# Altium project ece315.PrjPcb
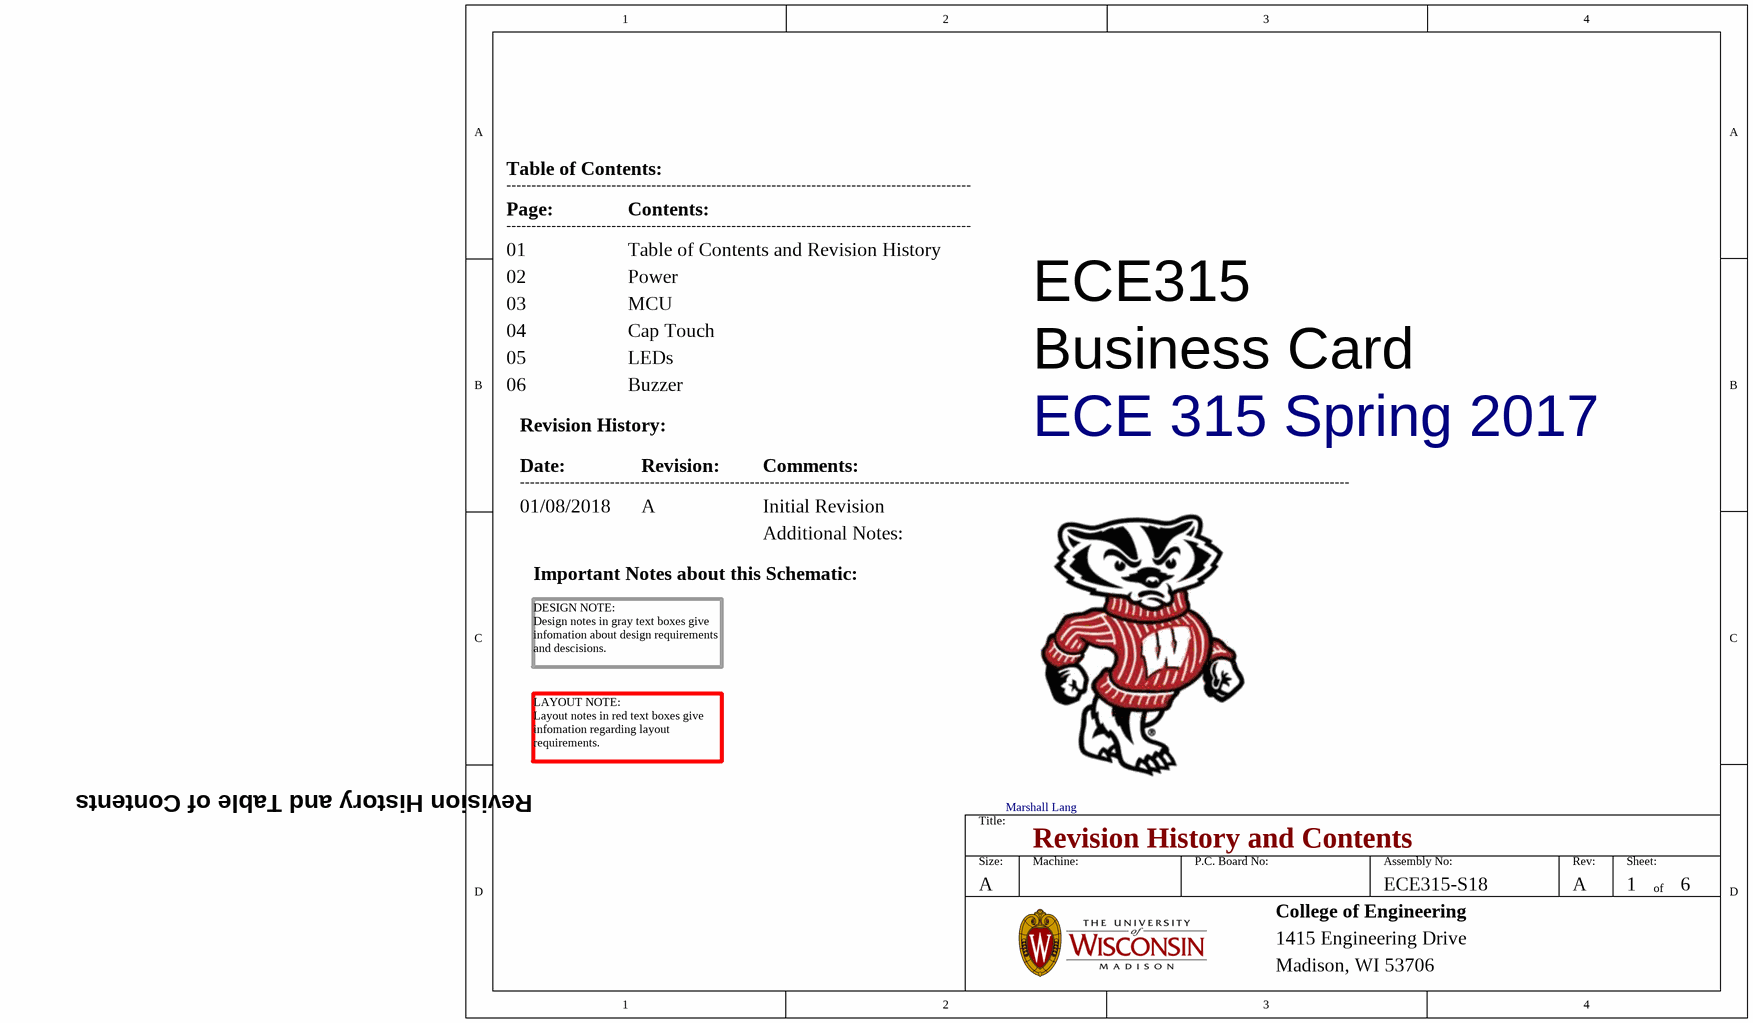
[diagram p0: 01-Revision_History_and_Contents.SchDoc]
AssemblyNumber: ECE315-S18
6 sheets, 65 parts. Net scope: global (net labels, ports and power ports of the same name join across sheets).
Board file: business_card.PcbDoc
Sheets:
  01-Revision_History_and_Contents.SchDoc
  02-Power.SchDoc
  03_MCU.SchDoc
  04_CapTouch.SchDoc
  05_LEDs.SchDoc
  06_Buzzer.SchDoc

## Sheet 01-Revision_History_and_Contents.SchDoc: Revision History and Contents
size A; Date: 01/08/2018; ApprovedBy: JSK; CheckedBy: JSK; Author: JSK; CompanyName: University of Wisconsin; DrawnBy: JSK; Engineer: JSK; Organization: ECE 315; Address1: College of Engineering; Address2: 1415 Engineering Drive; Address3: Madison, WI 53706; Address4: ECE 315 Spring 2017; Revision: A; SheetNumber: 1; SheetTotal: 6

### Notes on the sheet
- Table of Contents:
- Page:
- ---------------------------------------------------------------------------------------------
- Contents:
- 01
- 02
- Table of Contents and Revision History
- Power
- 03
- 04
- 05
- MCU
- Cap Touch
- LEDs
- ECE315
- 06
- Revision History:
- Buzzer
- Business Card
- Date:
- ----------------------------------------------------------------------------------------------------------------------------------------------------------------------
- Revision:
- Comments:
- 01/08/2018
- A
- Initial Revision
- Additional Notes:
- Important Notes about this Schematic:
- DESIGN NOTE:
  Design notes in gray text boxes give infomation about design requirements and descisions.
- LAYOUT NOTE:
  Layout notes in red text boxes give infomation regarding layout requirements.
- Revision History and Table of Contents
- Marshall Lang
- Title:
- Size:
- Machine:
- P.C. Board No:
- Assembly No:
- Rev:
- Sheet:
- of
- College of Engineering
- 1415 Engineering Drive
- Madison, WI 53706

## Sheet 02-Power.SchDoc: ECE315 Power and Programming
size A; Date: 01/08/2018; ApprovedBy: JSK; CheckedBy: JSK; Author: JSK; CompanyName: University of Wisconsin; DrawnBy: JSK; Engineer: JSK; Organization: ECE 315; Address1: College of Engineering; Address2: 1415 Engineering Drive; Address3: Madison, WI 53706; Address4: ECE 315 Spring 2018; Revision: A; SheetNumber: 2; SheetTotal: 6; AssemblyNumber: ECE315-S18; ApprovedDate: 4/25/2017
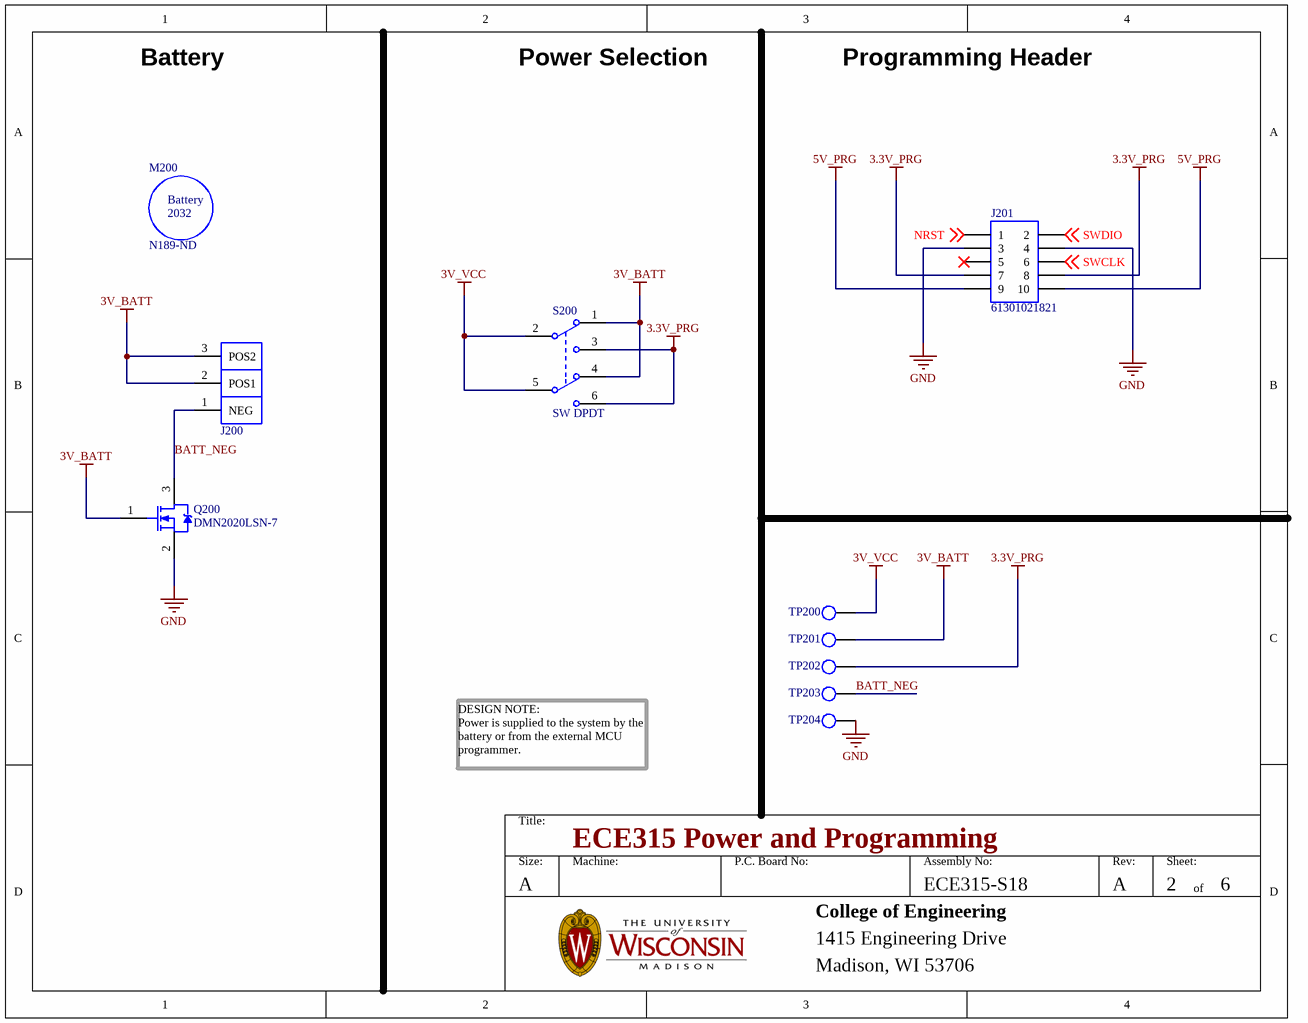
[diagram p1: 02-Power.SchDoc]

### Parts
J200  CONN_BAT_2032  [BATT_2032]  (value not drawn)
J201  Manufacturer Part Number: 61301021821  [HDR_5x2]  (hidden comment: CONN_ST_PROGRAMMER)
M200  Supplier Part Number 1: N189-ND  (hidden comment: BATTERY_2032)
Q200  Manufacturer Part Number: DMN2020LSN-7  [SOT23]  (hidden comment: IC_NMOS_DMN2020LSN)
S200  SW DPDT  [DPDT]
TP200  TP_1206  [TP-SMC-1206]  (value not drawn)
TP201  TP_1206  [TP-SMC-1206]  (value not drawn)
TP202  TP_1206  [TP-SMC-1206]  (value not drawn)
TP203  TP_1206  [TP-SMC-1206]  (value not drawn)
TP204  TP_1206  [TP-SMC-1206]  (value not drawn)

### Nets
3.3V_PRG: J201.7 J201.8 S200.3(NO1) S200.6(NO2) TP202.1
3V_BATT: J200.2(POS1) J200.3(POS2) Q200.1 S200.1(NC1) S200.4(NC2) TP201.1
3V_VCC: S200.2(COMMON1) S200.5(COMMON2) TP200.1
5V_PRG: J201.9 J201.10
GND: J201.3 J201.4 Q200.2 TP204.1
BATT_NEG: J200.1(NEG) Q200.3 TP203.1
NRST: J201.1 ; off-sheet NRST
SWCLK: J201.6 ; off-sheet SWCLK
SWDIO: J201.2 ; off-sheet SWDIO

Not connected (* = marked no-connect by the designer): J201 5*

### Notes on the sheet
- Battery
- Power Selection
- Programming Header
- DESIGN NOTE:
  Power is supplied to the system by the battery or from the external MCU programmer.
- Title:
- Size:
- A
- Machine:
- P.C. Board No:
- Assembly No:
- Rev:
- Sheet:
- of
- College of Engineering
- 1415 Engineering Drive
- Madison, WI 53706
- (in symbol BATTERY_2032) Battery; 2032

### Library data of the parts
J200 = CONN_BAT_2032: HOLDER BATTERY 20MM COIN; Manufacturer: Linx; Manufacturer Part Number: BAT-HLD-001; Brand: Linx Technologies; Number of Batteries: 1 Battery; Number of Contacts: 1 Contact; Battery Type, Function: Coin Cell, Retainer; Style: Retainer; Number of Cells: 1; Battery Series: 2025, 2032; Supplier 1: Digikey; Stock 1: 950; Pricing 1: 1=0.28, 25=0.2572, 100=0.233, 1000=0.2196 (USD); Product Category: Coin Cell Battery Holders; RoHS: Details; Product: Battery Holders; Battery Cell Size: 20 mm; Termination Style: SMD/SMT; Packaging: Bulk; Factory Pack Quantity: 1000; Type: 20 mm Battery Holder; ComponentLink1URL: https://datasheet.ciiva.com/4/bat-hld-001-4035.pdf; ComponentLink1Description: https://datasheet.ciiva.com/4/bat-hld-001-4035.pdf; ComponentLink2URL: https://datasheet.ciiva.com/4642/bat-hld-001-220194-4642567.pdf; ComponentLink2Description: https://datasheet.ciiva.com/4642/bat-hld-001-220194-4642567.pdf; ComponentLink3URL: https://datasheet.ciiva.com/16207/bat-hld-001-16207212.pdf; ComponentLink3Description: https://datasheet.ciiva.com/16207/bat-hld-001-16207212.pdf; Supplier Part Number 1: BAT-HLD-001-ND; Supplier 2: Digi-Key; Category: Battery Products; Stock 2: 69651; Pricing 2: 1=0.28, 25=0.2572, 100=0.233, 1000=0.2196 (USD); Part Status: Active; Mounting Type: PCB, Surface Mount; Height Above Board: 0.165" (4.20mm); Operating Temperature: -; ComponentLink4URL: https://www.linxtechnologies.com/resources/diagrams/bat-hld-001.pdf; ComponentLink4Description: https://www.linxtechnologies.com/resources/diagrams/bat-hld-001.pdf; Supplier Part Number 2: BAT-HLD-001-ND
J201 = CONN_ST_PROGRAMMER: CONN HEADER 2.54MM 10POS GOLD; Manufacturer: Wurth Electronics Inc.; Style: Board to Board; Number of Positions: 10; Number of Positions Loaded: All; Pitch - Mating: 0.100" (2.54mm); Contact Length - Post: 0.122" (3.10mm); Material Flammability Rating: UL94 V-0; Current Rating: 3A; Voltage Rating: 250VAC; Supplier 1: Digi-Key; RoHS: RoHS Compliant; Category: Connectors, Interconnects; Stock 1: 4086; Pricing 1: 1=0.74, 10=0.728, 50=0.672, 100=0.616, 320=0.56 (USD); Packaging: Tray; Part Status: Active; Connector Type: Header; Contact Type: Forked; Row Spacing - Mating: 0.100" (2.54mm); Mounting Type: Through Hole; Termination: Solder; Fastening Type: Push-Pull; Contact Finish - Mating: Gold; Contact Finish Thickness - Mating: -; Insulation Color: Black; Insulation Height: 0.331" (8.40mm); Operating Temperature: -40°C ~ 105°C; Contact Finish - Post: Gold; Mated Stacking Heights: -; Ingress Protection: -; Features: -; Applications: -; Insulation Material: Polybutylene Terephthalate (PBT); Contact Shape: Square; Contact Material: Copper Alloy; Contact Finish Thickness - Post: -; ComponentLink1URL: http://katalog.we-online.de/em/datasheet/6130xx21821.pdf; ComponentLink1Description: http://katalog.we-online.de/em/datasheet/6130xx21821.pdf; Supplier Part Number 1: 732-2861-ND
M200 = BATTERY_2032: Manufacturer: Energizer; Manufacturer Part Number: CR2032VP; MSDS Material Safety Datasheet: Lithium Manganese Dioxide(Coin/Button) PSDS; Battery Chemistry: Lithium; Battery Cell Size: Coin, 20.0mm; Voltage - Rated: 3V; Capacity: 240mAh; Discharge Rate: 190µA; Shipping Info: Due to possible restrictions, a change in ship method may be required.; Dynamic Catalog: CR (Coin) Series; For Use With: N533-ND / - CAP LIGHT 3-LED LITHIUM COIN; Associated Product: 952-1737-6-ND / - HOLDER BATT COIN CR2032/20MM / 952-1737-1-ND / - HOLDER BATT COIN CR2032/20MM / 952-1735-6-ND / - HOLDER BATT COIN CR2032/20MM / 952-1735-1-ND / - HOLDER BATT COIN CR2032/20MM / 952-1737-2-ND / - HOLDER BATT COIN CR2032/20MM / 952-1743-ND / - HOLDER BATT COIN CR2032/20MM / 952-1735-2-ND / - HOLDER BATT COIN CR2032/20MM / BH-20H-1TCT-ND / - HOLDER BATT COIN CELL 2032 SMD / 3082TRK-ND / - RETAINER COIN CELL 20MM SMD / 3072TRK-ND / - RETAINER COIN CELL 20MM SMD / More...; Other Names: 547-189 / 547-189-ND / N189; Supplier 1: Digikey; Stock 1: 563743; Pricing 1: 1=0.34, 10=0.31, 50=0.2758, 100=0.2414, 250=0.2207, 500=0.2069, 1000=0.1841, 2500=0.1729 (USD); Standard Package: 200; Category: Battery Products; Family: Batteries Non-Rechargeable (Primary); Series: CR2032; Size / Dimension: 0.79" Dia x 0.13" H (20.0mm x 3.2mm); Termination Style: Requires Holder; Weight: 0.1 oz (2.85g); ComponentLink1URL: https://datasheet.ciiva.com/6572/cr2032-6572607.pdf; ComponentLink1Description: https://datasheet.ciiva.com/6572/cr2032-6572607.pdf
Q200 = IC_NMOS_DMN2020LSN: Manufacturer: Diodes; Rise Time: 12.49ns; Continuous Drain Current (ID): 6.9A; Gate to Source Voltage (Vgs): 12V; Turn-Off Delay Time: 35.89ns; Turn-On Delay Time: 11.67ns; Fall Time: 12.33ns; Input Capacitance: 1.149nF; Number of Elements: 1; Max Power Dissipation: 610mW; Rds On Max: 20mR; Drain to Source Resistance: 13mR; Drain to Source Voltage (Vdss): 20V; Threshold Voltage: 1V; Element Configuration: Single; Supplier 1: Digikey; Stock 1: 13099; Pricing 1: 1=0.52, 10=0.418, 100=0.2843, 500=0.2132, 1000=0.1599 (USD); Mount: Surface Mount; Case/Package: SC; Number of Pins: 3; Weight: 0.000282oz; Min Operating Temperature: -55°C; Max Operating Temperature: 150°C; Packaging: Tape and Reel; Package Quantity: 3000; Power Dissipation: 610mW; Number of Channels: 1; Length: 3.1mm; Height: 1.3mm; Width: 1.7mm; REACH SVHC: No SVHC; Lead Free: Lead Free; ComponentLink1URL: https://datasheet.ciiva.com/934/ds31946-934870.pdf; ComponentLink1Description: https://datasheet.ciiva.com/934/ds31946-934870.pdf; ComponentLink2URL: https://datasheet.ciiva.com/25625/0900766b8104e58b-25625153.pdf; ComponentLink2Description: https://datasheet.ciiva.com/25625/0900766b8104e58b-25625153.pdf; ComponentLink3URL: https://datasheet.ciiva.com/4444/ds31946-65244-4444482.pdf; ComponentLink3Description: https://datasheet.ciiva.com/4444/ds31946-65244-4444482.pdf; ComponentLink4URL: https://datasheet.ciiva.com/934/ds31946-934871.pdf; ComponentLink4Description: https://datasheet.ciiva.com/934/ds31946-934871.pdf; ComponentLink5URL: https://datasheet.ciiva.com/934/ds31946-934872.pdf; ComponentLink5Description: https://datasheet.ciiva.com/934/ds31946-934872.pdf; Supplier Part Number 1: DMN2020LSN-7DICT-ND
S200 = SW DPDT: Switch; Manufacturer: ITT /  C&K Components; Manufacturer Part Number: JS202011SCQN; Actuator Color: Black; Maximum DC Voltage Rating: 6 V; Actuator Material: Nylon 4/6; Electrical Life: 15000 Cycles; Body Orientation: Straight; Maximum Contact Resistance: 70 mOhm; Actuator Style: Top Slide; Dielectric Strength: 500 VAC; Minimum Insulation Resistance: 100 MOhm; Contact Rating @ Voltage: 0.3@6VDC A; COO: US; Published: 24-Mar-1999; LatestRevisionDate: 29-May-2009; LatestRevisionNote: IPC-7351 Footprint Added.; PackageVersion: Mar-2001; PackageReference: SOT23-6; Publisher: Altium Limited; PackageDescription: 6-Pin SOT-23 Package 0.95 mm Pitch, 2.7 mm Lead Span; Code_JEITA: SC-74; Code_IPC: SOT26A-6; Supplier 1: C&K Components; Stock 1: 22661; Pricing 1: 1=0.46, 10=0.441, 25=0.4316, 50=0.3858, 100=0.3674, 250=0.3582, 500=0.3031 (USD); Part No: JS202011SCQN; RoHS: Yes; Supplier Standard Pack: 5,000; Type: Sub-Miniature; Maximum AC Voltage Rating: N/A; Family: JS; Contact Material: Copper Alloy; Seal Description: N/A; Pole Throw Configuration: DPDT; Mechanical Life: N/A; Packaging: Tape and Reel; Contact Plating: Silver; Switch Configuration: N/A; Housing Material: Nylon 4/6; Product Weight: N/A; Base Material: N/A; Mounting: Surface Mount,Gull Wing; Seal Location: N/A; Operating Temperature: -40 to 85 C; Dimension: 9 x 7.5 x 5.5 mm; HTS: 8536509050; ECCN: EAR99; ComponentLink1URL: https://datasheet.ciiva.com/23829/1707718-23829488.pdf; ComponentLink1Description: https://datasheet.ciiva.com/23829/1707718-23829488.pdf; ComponentLink2URL: https://datasheet.ciiva.com/2889/js-29aug13-2889127.pdf; ComponentLink2Description: https://datasheet.ciiva.com/2889/js-29aug13-2889127.pdf; ComponentLink3URL: https://datasheet.ciiva.com/2889/js-15sept15-2889128.pdf; ComponentLink3Description: https://datasheet.ciiva.com/2889/js-15sept15-2889128.pdf; ComponentLink4URL: https://datasheet.ciiva.com/2889/js-15sept15-2889129.pdf; ComponentLink4Description: https://datasheet.ciiva.com/2889/js-15sept15-2889129.pdf; ComponentLink5URL: https://datasheet.ciiva.com/22630/1707718-22630697.pdf; ComponentLink5Description: https://datasheet.ciiva.com/22630/1707718-22630697.pdf; ComponentLink6URL: https://datasheet.ciiva.com/8625/js-9dec14-8625470.pdf; ComponentLink6Description: https://datasheet.ciiva.com/8625/js-9dec14-8625470.pdf; Supplier Part Number 1: 401-2002-1-ND
TP200-TP204 = TP_1206: Test Point SMD 1206; Manufacturer: TE Connectivity (Tyco Electronics); Manufacturer Part Number: 1625854-1; Resistance Value: 0 Ohm; Temperature Coefficient: N/R; Supplier 1: Digi-Key; Supplier Part Number 1: A106143CT-ND; Stock 1: 31937; Pricing 1: 1=0.28, 10=0.261, 25=0.224, 50=0.1902, 100=0.1828, 250=0.1641, 500=0.1567, 1000=0.1306 (USD); Case Size: 1206; Dimension: 3.2 x 1.6 x 1.25mm; Family: RC; Mounting: Surface Mount; Operating Temperature: -55 to 125 C; Part No: 1625854-1; RoHS: Yes; Packaging: Tape and Reel; Termination Style: N/R; Terminal Pitch: N/R; Power Rating: N/R; Tolerance: N/R; ComponentLink1URL: https://datasheet.ciiva.com/6439/eng-ds-1773266-a-6439169.pdf; ComponentLink1Description: https://datasheet.ciiva.com/6439/eng-ds-1773266-a-6439169.pdf; ComponentLink2URL: https://datasheet.ciiva.com/30136/1773266-a-30136341.pdf; ComponentLink2Description: https://datasheet.ciiva.com/30136/1773266-a-30136341.pdf; ComponentLink3URL: https://datasheet.ciiva.com/6439/eng-ds-1773266-a-6439080.pdf; ComponentLink3Description: https://datasheet.ciiva.com/6439/eng-ds-1773266-a-6439080.pdf; ComponentLink4URL: https://datasheet.ciiva.com/6439/eng-ds-1773266-a-6439081.pdf; ComponentLink4Description: https://datasheet.ciiva.com/6439/eng-ds-1773266-a-6439081.pdf; ComponentLink5URL: https://datasheet.ciiva.com/6439/eng-ds-1773266-a-6439083.pdf; ComponentLink5Description: https://datasheet.ciiva.com/6439/eng-ds-1773266-a-6439083.pdf

## Sheet 03_MCU.SchDoc: ECE315 MCU
size A; Date: 4/25/2017; ApprovedBy: JSK; CheckedBy: JSK; Author: JSK; CompanyName: University of Wisconsin; DrawnBy: JSK; Engineer: JSK; Organization: ECE 315; Address1: College of Engineering; Address2: 1415 Engineering Drive; Address3: Madison, WI 53706; Address4: ECE 315 Spring 2018; Revision: A; SheetNumber: 3; SheetTotal: 6; AssemblyNumber: ECE315-S18; ApprovedDate: 01/08/2018
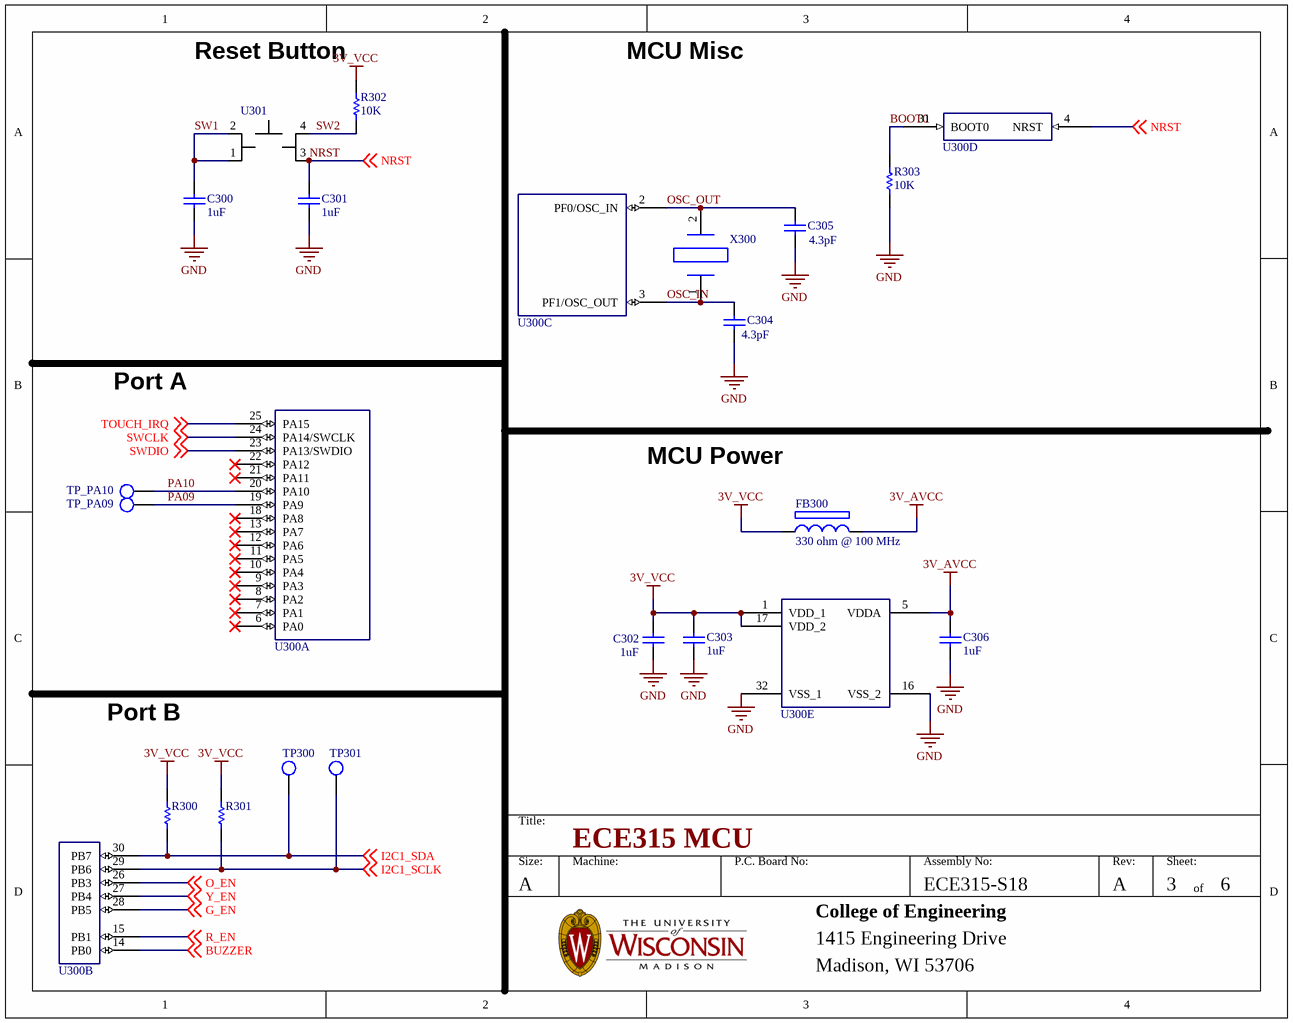
[diagram p2: 03_MCU.SchDoc]

### Parts
C300  Supplier Part Number 1: 1uF  [CAP_0805]  (hidden comment: CAP_0805_U_001.00)
C301  Supplier Part Number 1: 1uF  [CAP_0805]  (hidden comment: CAP_0805_U_001.00)
C302  Supplier Part Number 1: 1uF  [CAP_0805]  (hidden comment: CAP_0805_U_001.00)
C303  Supplier Part Number 1: 1uF  [CAP_0805]  (hidden comment: CAP_0805_U_001.00)
C304  4.3pF  [CAP_0805]
C305  4.3pF  [CAP_0805]
C306  Supplier Part Number 1: 1uF  [CAP_0805]  (hidden comment: CAP_0805_U_001.00)
FB300  330 ohm @ 100 MHz  [FB_0805]
R300  10K  [RES_0805]  (value not drawn)
R301  10K  [RES_0805]  (value not drawn)
R302  10K  [RES_0805]
R303  10K  [RES_0805]
TP300  TP_1206  [TP-SMC-1206]  (value not drawn)
TP301  TP_1206  [TP-SMC-1206]  (value not drawn)
TP_PA09  TP_1206  [TP-SMC-1206]  (value not drawn)
TP_PA10  TP_1206  [TP-SMC-1206]  (value not drawn)
U300  IC_STM32F303K8T6_1  [IC_STM32FM]  (value not drawn)  (parts A,B,C,D,E of 5)
U301  SW_6mm_6mm_SMT  [SW_6mm_6mm_SMT]  (value not drawn)
X300  32.7680KHZ 12.5PF  [NX3215SA-32.768K-STD-MUA-8]  (value not drawn)

### Nets
3V_AVCC: C306.1 FB300.2 U300.5(VDDA)
3V_VCC: C302.1 C303.1 FB300.1 R300.2 R301.2 R302.2 U300.1(VDD_1) U300.17(VDD_2)
GND: C300.2 C301.2 C302.2 C303.2 C304.1 C305.1 C306.2 R303.1 U300.16(VSS_2) U300.32(VSS_1)
BOOT0: R303.2 U300.31(BOOT0)
BUZZER: U300.14(PB0) ; off-sheet BUZZER
G_EN: U300.28(PB5) ; off-sheet G_EN
I2C1_SCLK: R301.1 TP301.1 U300.29(PB6) ; off-sheet I2C1_SCLK
I2C1_SDA: R300.1 TP300.1 U300.30(PB7) ; off-sheet I2C1_SDA
NRST: C301.1 U300.4(NRST) U301.3 ; off-sheet NRST
O_EN: U300.26(PB3) ; off-sheet O_EN
OSC_IN: C304.2 U300.3(PF1/OSC_OUT) X300.1
OSC_OUT: C305.2 U300.2(PF0/OSC_IN) X300.2
PA09: TP_PA09.1 U300.19(PA9)
PA10: TP_PA10.1 U300.20(PA10)
R_EN: U300.15(PB1) ; off-sheet R_EN
SW1: C300.1 U301.1 U301.2
SW2: R302.1 U301.4(VCCIO)
SWCLK: U300.24(PA14/SWCLK) ; off-sheet SWCLK
SWDIO: U300.23(PA13/SWDIO) ; off-sheet SWDIO
TOUCH_IRQ: U300.25(PA15) ; off-sheet TOUCH_IRQ
Y_EN: U300.27(PB4) ; off-sheet Y_EN

Not connected (* = marked no-connect by the designer): U300 6(PA0)* 7(PA1)* 8(PA2)* 9(PA3)* 10(PA4)* 11(PA5)* 12(PA6)* 13(PA7)* 18(PA8)* 21(PA11)* 22(PA12)*

### Notes on the sheet
- Reset Button
- MCU Misc
- Port A
- MCU Power
- Port B
- Title:
- Size:
- A
- Machine:
- P.C. Board No:
- Assembly No:
- Rev:
- Sheet:
- of
- College of Engineering
- 1415 Engineering Drive
- Madison, WI 53706

### Library data of the parts
C300-C303 C306 = CAP_0805_U_001.00: CAP CER 1UF 16V 10% X7R 0805; Manufacturer: Yageo; Manufacturer Part Number: CC0805KKX7R7BB105; Notification: Current market demand for these product types have resulted in fluctuating and extending lead times. Lead times may differ.; Supplier 1: Digi-Key; RoHS: RoHS Compliant; Category: Capacitors; Stock 1: 1059529; Pricing 1: 1=0.11, 10=0.079, 100=0.0352, 500=0.02516, 1000=0.01977 (USD); Packaging: Cut Tape (CT); Part Status: Active; Tolerance: ±10%; Voltage - Rated: 16V; Temperature Coefficient: X7R; Operating Temperature: -55°C ~ 125°C; Features: -; Ratings: -; Applications: General Purpose; Failure Rate: -; Mounting Type: Surface Mount, MLCC; Package / Case: 0805 (2012 Metric); Size / Dimension: 0.079" L x 0.049" W (2.00mm x 1.25mm); Height - Seated (Max): -; Thickness (Max): 0.049" (1.25mm); Lead Spacing: -; Lead Style: -; ComponentLink1URL: http://www.yageo.com/documents/recent/UPY-GPHC_X7R_6.3V-to-50V_18.pdf; ComponentLink1Description: http://www.yageo.com/documents/recent/UPY-GPHC_X7R_6.3V-to-50V_18.pdf
C304 C305 = CAP_0805_P_004.30: CAP CER 4.3PF 100V NP0 0805; Manufacturer: AVX Corporation; Manufacturer Part Number: 08051A4R3BAT2A; Tolerance: ±0.1pF; Temperature Coefficient: C0G, NP0; Notification: Current market demand for these product types have resulted in fluctuating and extending lead times. Lead times may differ.; Supplier 1: Digi-Key; RoHS: RoHS Compliant; Category: Capacitors; Stock 1: 0; Pricing 1: 4000=0.231 (USD); Packaging: Tape & Reel (TR); Part Status: Active; Voltage - Rated: 100V; Operating Temperature: -55°C ~ 125°C; Features: -; Ratings: -; Applications: General Purpose; Failure Rate: -; Mounting Type: Surface Mount, MLCC; Package / Case: 0805 (2012 Metric); Size / Dimension: 0.079" L x 0.049" W (2.01mm x 1.25mm); Height - Seated (Max): -; Thickness (Max): 0.037" (0.94mm); Lead Spacing: -; Lead Style: -; ComponentLink1URL: http://datasheets.avx.com/C0GNP0-Dielectric.pdf; ComponentLink1Description: http://datasheets.avx.com/C0GNP0-Dielectric.pdf
FB300 = FB 330 ohm @ 100 MHz: Manufacturer: TDK Corporation; Manufacturer Part Number: MPZ2012S331AT000; Current Rating: 2.5A; DC Resistance (DCR): 50 mOhm Max; Filter Type: Differential Mode - Single; Supplier 1: Digi-Key; RoHS: RoHS Compliant; Category: Filters; Stock 1: 154063; Pricing 1: 1=0.12, 10=0.101, 100=0.0574, 250=0.04528, 500=0.03824, 1000=0.03221 (USD); Packaging: Cut Tape (CT); Impedance @ Frequency: 330 Ohm @ 100MHz; Package / Case: 0805 (2012 Metric); Mounting Type: Surface Mount; Height (Max): 0.041" (1.05mm); Size / Dimension: 0.079" L x 0.049" W (2.00mm x 1.25mm); ComponentLink1URL: http://product.tdk.com/en/catalog/datasheets/beads_commercial_power_mpz_en.pdf; ComponentLink1Description: http://product.tdk.com/en/catalog/datasheets/beads_commercial_power_mpz_en.pdf; Supplier Part Number 1: 445-1569-1-ND
R300-R303 = RES_0805_K_010.00: RES SMD 10K OHM 1% 1/8W 0805; Manufacturer: Yageo; Manufacturer Part Number: RC0805FR-0710KL; Power (Watts): 0.125W, 1/8W; Temperature Coefficient: ±100ppm/°C; Supplier 1: Digi-Key; RoHS: RoHS Compliant; Category: Resistors; Stock 1: 15506828; Pricing 1: 1=0.1, 10=0.022, 100=0.0088, 1000=0.00396, 2500=0.00344 (USD); Packaging: Cut Tape (CT); Part Status: Active; Tolerance: ±1%; Composition: Thick Film; Features: Moisture Resistant; Operating Temperature: -55°C ~ 155°C; Package / Case: 0805 (2012 Metric); Supplier Device Package: 0805; Size / Dimension: 0.079" L x 0.049" W (2.00mm x 1.25mm); Height - Seated (Max): 0.024" (0.60mm); Failure Rate: -; ComponentLink1URL: http://www.yageo.com/documents/recent/PYu-RC_Group_51_RoHS_L_8.pdf; ComponentLink1Description: http://www.yageo.com/documents/recent/PYu-RC_Group_51_RoHS_L_8.pdf
  R300 R301: Supplier Part Number 1: 311-10.0KCRCT-ND
  R302 R303: Supplier Part Number 1: 10K
TP300 TP301 TP_PA09 TP_PA10 = TP_1206: as TP200 on sheet 02-Power; Supplier 1: Digi-Key; Stock 1: 31937; Pricing 1: 1=0.28, 10=0.261, 25=0.224, 50=0.1902, 100=0.1828, 250=0.1641, 500=0.1567, 1000=0.1306 (USD); Case Size: 1206; Dimension: 3.2 x 1.6 x 1.25mm; Family: RC; Mounting: Surface Mount; Operating Temperature: -55 to 125 C; Part No: 1625854-1; RoHS: Yes; Packaging: Tape and Reel; Termination Style: N/R; Terminal Pitch: N/R; Power Rating: N/R; Tolerance: N/R; ComponentLink1URL: https://datasheet.ciiva.com/6439/eng-ds-1773266-a-6439169.pdf; ComponentLink1Description: https://datasheet.ciiva.com/6439/eng-ds-1773266-a-6439169.pdf; ComponentLink2URL: https://datasheet.ciiva.com/30136/1773266-a-30136341.pdf; ComponentLink2Description: https://datasheet.ciiva.com/30136/1773266-a-30136341.pdf; ComponentLink3URL: https://datasheet.ciiva.com/6439/eng-ds-1773266-a-6439080.pdf; ComponentLink3Description: https://datasheet.ciiva.com/6439/eng-ds-1773266-a-6439080.pdf; ComponentLink4URL: https://datasheet.ciiva.com/6439/eng-ds-1773266-a-6439081.pdf; ComponentLink4Description: https://datasheet.ciiva.com/6439/eng-ds-1773266-a-6439081.pdf; ComponentLink5URL: https://datasheet.ciiva.com/6439/eng-ds-1773266-a-6439083.pdf; ComponentLink5Description: https://datasheet.ciiva.com/6439/eng-ds-1773266-a-6439083.pdf; Supplier Part Number 1: A106143CT-ND
U301 = SW_6mm_6mm_SMT: SWITCH TACTILE SPST-NO 0.05A 12V; Manufacturer: C&K; Manufacturer Part Number: PTS645SK50SMTR92 LFS; Switch Function: Off-Mom; Contact Rating @ Voltage: 0.05A @ 12VDC; Actuator Type: Standard; Actuator Height off PCB, Vertical: 5.00mm; Actuator Orientation: Top Actuated; Outline: 6.00mm x 6.00mm; Illumination: Non-Illuminated; Operating Force: 260gf; Actuator Material: Polyamide (PA66), Nylon 6/6; Mechanical Life: 100,000 Cycles; Supplier 1: Digi-Key; RoHS: RoHS Compliant; Category: Switches; Stock 1: 162000; Pricing 1: 1000=0.11797, 5000=0.09774 (USD); Packaging: Tape & Reel (TR); Part Status: Active; Circuit: SPST-NO; Mounting Type: Surface Mount; Actuator Length, Right Angle: -; Termination Style: Gull Wing; Illumination Type, Color: -; Illumination Voltage (Nominal): -; Ingress Protection: -; Features: -; Switch Travel: -; Operating Temperature: -20°C ~ 60°C; ComponentLink1URL: http://www.ckswitches.com/media/1471/pts645.pdf; ComponentLink1Description: http://www.ckswitches.com/media/1471/pts645.pdf; Supplier Part Number 1: CKN9087TR-ND
X300 = CRYSTAL_NX3215SA-32.768K: CRYSTAL 32.768KHZ 12.5PF SMD; Manufacturer: Nihon Dempa Kogyo (NDK); Catalog Drawings: NX3215SA Series Top / NX3215SA Series Side / NX3215SA Series Bottom / NX3215SA Series Circuit; Featured Product: NX3215SA Series 32.768KHz SMD Crystals; Frequency Tolerance: ±20ppm; ESR (Equivalent Series Resistance): 70 kOhm; Operating Mode: Fundamental; Dynamic Catalog: NX3215SA Series; Other Names: 644-1156-6; Supplier 1: Digikey; Stock 1: 45314; Pricing 1: 1=0.94, 10=0.835, 50=0.7804, 100=0.6897, 500=0.6534, 1000=0.5445 (USD); Standard Package: 1; Category: Crystals and Oscillators; Family: Crystals; Series: NX3215SA; Type: kHz Crystal (Tuning Fork); Frequency: 32.768kHz; Load Capacitance: 12.5pF; Operating Temperature: -40°C ~ 85°C; Mounting Type: Surface Mount; Package / Case: 2-SMD; Size / Dimension: 0.126" L x 0.059" W (3.20mm x 1.50mm); Height: 0.035" (0.90mm); Packaging: Digi-Reel®; ComponentLink1URL: https://datasheet.ciiva.com/857/c-nx3215sa-std-mua-9-e-857050.pdf; ComponentLink1Description: https://datasheet.ciiva.com/857/c-nx3215sa-std-mua-9-e-857050.pdf; ComponentLink2URL: https://datasheet.ciiva.com/857/c-nx3215sa-std-mua-9-e-857051.pdf; ComponentLink2Description: https://datasheet.ciiva.com/857/c-nx3215sa-std-mua-9-e-857051.pdf; ComponentLink3URL: https://datasheet.ciiva.com/857/c-nx3215sa-std-mua-9-e-857052.pdf; ComponentLink3Description: https://datasheet.ciiva.com/857/c-nx3215sa-std-mua-9-e-857052.pdf; Supplier Part Number 1: 644-1156-1-ND; Manufacturer Part Number: NX3215SA-32.768K-STD-MUA-8

## Sheet 04_CapTouch.SchDoc: ECE315 Capacitive Touch
size A; Date: 01/08/2018; ApprovedBy: JSK; CheckedBy: JSK; Author: JSK; CompanyName: University of Wisconsin; DrawnBy: JSK; Engineer: JSK; Organization: ECE 315; Address1: College of Engineering; Address2: 1415 Engineering Drive; Address3: Madison, WI 53706; Address4: ECE 315 Spring 2018; Revision: A; SheetNumber: 4; SheetTotal: 6; AssemblyNumber: ECE315-S18; ApprovedDate: 4/25/2017
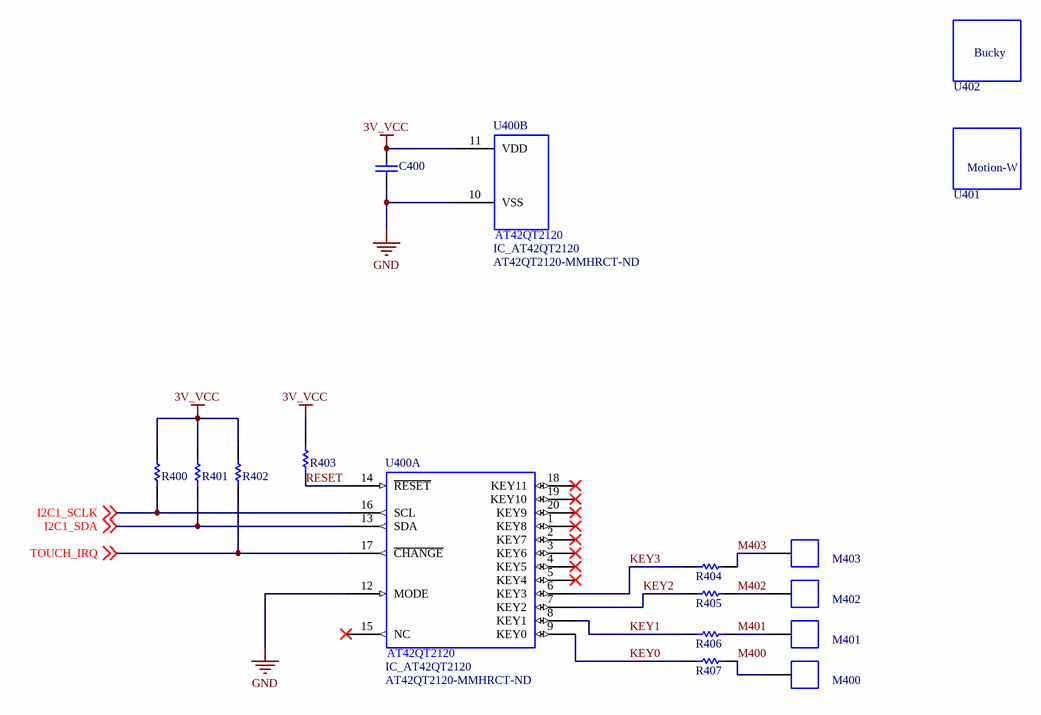
[diagram p3: 04_CapTouch.SchDoc]

### Parts
C400  CAP_0805_U_001.00  [CAP_0805]  (value not drawn)
M400  Mech_TouchPad  [TouchPad]  (value not drawn)  (no BOM)
M401  Mech_TouchPad  [TouchPad]  (value not drawn)  (no BOM)
M402  Mech_TouchPad  [TouchPad]  (value not drawn)  (no BOM)
M403  Mech_TouchPad  [TouchPad]  (value not drawn)  (no BOM)
R400  RES_0805_R_562_00  [RES_0805]  (value not drawn)
R401  RES_0805_R_562_00  [RES_0805]  (value not drawn)
R402  RES_0805_R_562_00  [RES_0805]  (value not drawn)
R403  RES_0805_R_562_00  [RES_0805]  (value not drawn)
R404  RES_0805_R_562_00  [RES_0805]  (value not drawn)
R405  RES_0805_R_562_00  [RES_0805]  (value not drawn)
R406  RES_0805_R_562_00  [RES_0805]  (value not drawn)
R407  RES_0805_R_562_00  [RES_0805]  (value not drawn)
U400  IC_AT42QT2120  Supplier Part Number 1: AT42QT2120-MMHRCT-ND  [IC_AT42QT2120]  (parts A,B of 2)
U401  Motion_W  [Motion_W]  (value not drawn)  (no BOM)
U402  Bucky  [BuckyBadger]  (value not drawn)  (no BOM)

### Nets
3V_VCC: C400.1 R400.2 R401.2 R402.2 R403.2 U400.11(VDD)
GND: C400.2 U400.10(VSS) U400.12(MODE)
I2C1_SCLK: R400.1 U400.16(SCL) ; off-sheet I2C1_SCLK
I2C1_SDA: R401.1 U400.13(SDA) ; off-sheet I2C1_SDA
KEY0: R407.1 U400.9(KEY0)
KEY1: R406.1 U400.8(KEY1)
KEY2: R405.1 U400.7(KEY2)
KEY3: R404.1 U400.6(KEY3)
M400: M400.1 R407.2
M401: M401.1 R406.2
M402: M402.1 R405.2
M403: M403.1 R404.2
RESET: R403.1 U400.14(~{RESET})
TOUCH_IRQ: R402.1 U400.17(~{CHANGE}) ; off-sheet TOUCH_IRQ

Not connected (* = marked no-connect by the designer): U400 1(KEY8)* 2(KEY7)* 3(KEY6)* 4(KEY5)* 5(KEY4)* 15(NC)* 18(KEY11)* 19(KEY10)* 20(KEY9)*

### Notes on the sheet
- Title:
- Size:
- A
- Machine:
- P.C. Board No:
- Assembly No:
- Rev:
- Sheet:
- of
- College of Engineering
- 1415 Engineering Drive
- Madison, WI 53706
- (in symbol IC_AT42QT2120, part A) AT42QT2120
- (in symbol IC_AT42QT2120, part B) AT42QT2120
- (in symbol Motion_W) Motion-W

### Library data of the parts
C400 = CAP_0805_U_001.00: as C300 on sheet 03_MCU; Supplier 1: Digi-Key; RoHS: RoHS Compliant; Category: Capacitors; Stock 1: 1059529; Pricing 1: 1=0.11, 10=0.079, 100=0.0352, 500=0.02516, 1000=0.01977 (USD); Packaging: Cut Tape (CT); Part Status: Active; Tolerance: ±10%; Voltage - Rated: 16V; Temperature Coefficient: X7R; Operating Temperature: -55°C ~ 125°C; Features: -; Ratings: -; Applications: General Purpose; Failure Rate: -; Mounting Type: Surface Mount, MLCC; Package / Case: 0805 (2012 Metric); Size / Dimension: 0.079" L x 0.049" W (2.00mm x 1.25mm); Height - Seated (Max): -; Thickness (Max): 0.049" (1.25mm); Lead Spacing: -; Lead Style: -; ComponentLink1URL: http://www.yageo.com/documents/recent/UPY-GPHC_X7R_6.3V-to-50V_18.pdf; ComponentLink1Description: http://www.yageo.com/documents/recent/UPY-GPHC_X7R_6.3V-to-50V_18.pdf; Supplier Part Number 1: 311-1365-1-ND
M400-M403 = Mech_TouchPad: Capacative Touch Sensor Pad
R400-R407 = RES_0805_R_562_00: RES SMD 562 OHM 1% 1/8W 0805; Manufacturer: Yageo; Manufacturer Part Number: RC0805FR-07562RL; Power (Watts): 0.125W, 1/8W; Temperature Coefficient: ±100ppm/°C; Supplier 1: Digi-Key; RoHS: RoHS Compliant; Category: Resistors; Stock 1: 495223; Pricing 1: 1=0.1, 10=0.022, 100=0.0088, 1000=0.00396, 2500=0.00344 (USD); Packaging: Cut Tape (CT); Part Status: Active; Tolerance: ±1%; Composition: Thick Film; Features: Moisture Resistant; Operating Temperature: -55°C ~ 155°C; Package / Case: 0805 (2012 Metric); Supplier Device Package: 0805; Size / Dimension: 0.079" L x 0.049" W (2.00mm x 1.25mm); Height - Seated (Max): 0.024" (0.60mm); Failure Rate: -; ComponentLink1URL: http://www.yageo.com/documents/recent/PYu-RC_Group_51_RoHS_L_8.pdf; ComponentLink1Description: http://www.yageo.com/documents/recent/PYu-RC_Group_51_RoHS_L_8.pdf; Supplier Part Number 1: 311-562CRCT-ND
U400 = IC_AT42QT2120: Manufacturer: Microchip Technology; Manufacturer Part Number: AT42QT2120-MMHR; Proximity Detection: Yes; Number of Inputs: Up to 12; LED Driver Channels: Up to 10; Interface: I²C; Voltage - Supply: 1.8 V ~ 5.5 V; Supplier 1: Digi-Key; RoHS: RoHS Compliant; Category: Integrated Circuits (ICs); Stock 1: 5883; Pricing 1: 1=1.47, 25=1.3464, 100=1.219 (USD); Packaging: Cut Tape (CT); Part Status: Active; Type: Buttons, Slider, Wheel; Resolution: -; Current - Supply: -; Operating Temperature: -40°C ~ 85°C; Package / Case: 20-VFQFN Exposed Pad; Supplier Device Package: 20-VQFN (3x3); ComponentLink1URL: http://www.microchip.com/mymicrochip/filehandler.aspx?ddocname=en590755; ComponentLink1Description: http://www.microchip.com/mymicrochip/filehandler.aspx?ddocname=en590755
U401 = Motion_W: Motion W Image; Manufacturer Part Number: UW Bucky
U402 = Bucky: Bucky Badger Image; Manufacturer Part Number: UW Bucky

## Sheet 05_LEDs.SchDoc: ECE315 LEDs
size A; Date: 01/08/2018; ApprovedBy: JSK; CheckedBy: JSK; Author: JSK; CompanyName: University of Wisconsin; DrawnBy: JSK; Engineer: JSK; Organization: ECE 315; Address1: College of Engineering; Address2: 1415 Engineering Drive; Address3: Madison, WI 53706; Address4: ECE 315 Spring 2018; Revision: A; SheetNumber: 5; SheetTotal: 6; AssemblyNumber: ECE315-S18; ApprovedDate: ECE315-S18
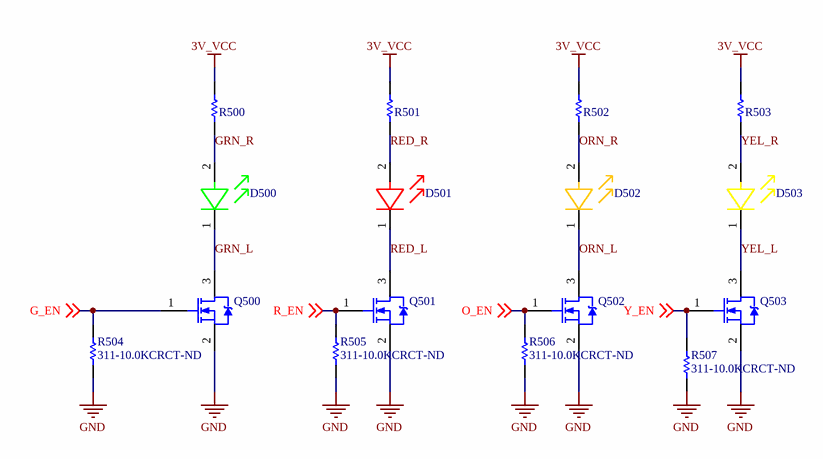
[diagram p4: 05_LEDs.SchDoc]

### Parts
D500  LED_GREEN_0805.1  [LED_GRN_0805]  (value not drawn)
D501  LED_RED_0805.1  [LED_RED_0805]  (value not drawn)
D502  LED_ORANGE.0805.1  [LED_ORG_0805]  (value not drawn)
D503  LED_YELLOW_0805.1  [LED_YEL_0805]  (value not drawn)
Q500  IC_NMOS_DMN2020LSN  [SOT23]  (value not drawn)
Q501  IC_NMOS_DMN2020LSN  [SOT23]  (value not drawn)
Q502  IC_NMOS_DMN2020LSN  [SOT23]  (value not drawn)
Q503  IC_NMOS_DMN2020LSN  [SOT23]  (value not drawn)
R500  330  [RES_0805]  (value not drawn)
R501  330  [RES_0805]  (value not drawn)
R502  330  [RES_0805]  (value not drawn)
R503  330  [RES_0805]  (value not drawn)
R504  Supplier Part Number 1: 311-10.0KCRCT-ND  [RES_0805]  (hidden comment: 10K)
R505  Supplier Part Number 1: 311-10.0KCRCT-ND  [RES_0805]  (hidden comment: 10K)
R506  Supplier Part Number 1: 311-10.0KCRCT-ND  [RES_0805]  (hidden comment: 10K)
R507  Supplier Part Number 1: 311-10.0KCRCT-ND  [RES_0805]  (hidden comment: 10K)

### Nets
3V_VCC: R500.2 R501.2 R502.2 R503.2
GND: Q500.2 Q501.2 Q502.2 Q503.2 R504.1 R505.1 R506.1 R507.1
G_EN: Q500.1 R504.2 ; off-sheet G_EN
GRN_L: D500.1(Cathode) Q500.3
GRN_R: D500.2(Anode) R500.1
O_EN: Q502.1 R506.2 ; off-sheet O_EN
ORN_L: D502.1(Cathode) Q502.3
ORN_R: D502.2(Anode) R502.1
R_EN: Q501.1 R505.2 ; off-sheet R_EN
RED_L: D501.1(Cathode) Q501.3
RED_R: D501.2(Anode) R501.1
Y_EN: Q503.1 R507.2 ; off-sheet Y_EN
YEL_L: D503.1(Cathode) Q503.3
YEL_R: D503.2(Anode) R503.1

### Notes on the sheet
- Title:
- Size:
- A
- Machine:
- P.C. Board No:
- Assembly No:
- Rev:
- Sheet:
- of
- College of Engineering
- 1415 Engineering Drive
- Madison, WI 53706

### Library data of the parts
D500 = LED_GREEN_0805.1: LED GREEN CLEAR THIN 0805 SMD; Manufacturer: Vishay / Lite-On; Manufacturer Part Number: LTST-C171KGKT; Chip Material: AlGaInP; DELETED: Compliant; Emitting Color: Yellow Green; Forward Voltage: 2.4 V; Forward Current: 30 mA; Dominant Wave Length: 571 nm; Lum Intensity: 35mcd; High Brightness: Yes; Number of  Elements: 1; Main Category: Chip LED; Power Dissipation: 75 W; Peak Wavelength: 574 nm; Shape Type: Rectangular; Type: Uni-Color; Reverse Voltage: 5 V; Viewing Angle: 130 deg; Test Current (It): 20 mA; Rad Hardened: No; Product Depth (mm): 1.25 mm; Product Height (mm): 0.8 mm; Product Length (mm): 2 mm; Supplier 1: Digi-Key; Stock 1: 322411; Pricing 1: 1=0.31, 10=0.225, 25=0.1656, 100=0.1183, 250=0.0804, 500=0.071, 1000=0.0556 (USD); Mounting: Surface Mount; Operating Temp Range: -55C to 85C; Lens Dimensions: 1.4x1.25x0.5 mm; Luminous Intensity: 35mcd; Package Type: Chip Led; Packaging: Tape and Reel; Pin Count: 2; Operating Temperature Classification: Industrial; ComponentLink1URL: https://datasheet.ciiva.com/15118/getdatasheetpartid-214542-15118099.pdf; ComponentLink1Description: https://datasheet.ciiva.com/15118/getdatasheetpartid-214542-15118099.pdf; ComponentLink2URL: https://datasheet.ciiva.com/16200/lite-on20ltst-c171kgkt-16200100.pdf; ComponentLink2Description: https://datasheet.ciiva.com/16200/lite-on20ltst-c171kgkt-16200100.pdf; ComponentLink3URL: https://datasheet.ciiva.com/2110/s-110-ltst-c171kgkt-2110072.pdf; ComponentLink3Description: https://datasheet.ciiva.com/2110/s-110-ltst-c171kgkt-2110072.pdf; ComponentLink4URL: https://datasheet.ciiva.com/2110/s-110-ltst-c171kgkt-2110073.pdf; ComponentLink4Description: https://datasheet.ciiva.com/2110/s-110-ltst-c171kgkt-2110073.pdf; ComponentLink5URL: https://datasheet.ciiva.com/11774/0900766b80dc0298-11774377.pdf; ComponentLink5Description: https://datasheet.ciiva.com/11774/0900766b80dc0298-11774377.pdf; ComponentLink6URL: https://datasheet.ciiva.com/2110/s-110-ltst-c171kgkt-2110074.pdf; ComponentLink6Description: https://datasheet.ciiva.com/2110/s-110-ltst-c171kgkt-2110074.pdf; ComponentLink7URL: https://datasheet.ciiva.com/12400/lite-on-ltst-c171kgkt-187692-12400799.pdf; ComponentLink7Description: https://datasheet.ciiva.com/12400/lite-on-ltst-c171kgkt-187692-12400799.pdf; Supplier Part Number 1: 160-1426-1-ND
D501 = LED_RED_0805.1: LED SUPER RED CLR THIN 0805 SMD; Manufacturer: Vishay / Lite-On; Manufacturer Part Number: LTST-C171KRKT; Chip Material: AlGaInP; DELETED: Compliant; Dominant Wave Length: 631 nm; Forward Current: 30 mA; Forward Voltage: 2.4 V; High Brightness: Yes; Lum Intensity: 54mcd; Main Category: Chip LED; Number of  Elements: 1; Peak Wavelength: 639 nm; Power Dissipation: 75 W; Product Depth (mm): 1.25 mm; Product Height (mm): 0.8 mm; Product Length (mm): 2 mm; Rad Hardened: No; Reverse Voltage: 5 V; Shape Type: Rectangular; Test Current (It): 20 mA; Type: Uni-Color; Viewing Angle: 130 deg; Supplier 1: Digikey; Stock 1: 97347; Pricing 1: 1=0.31, 10=0.225, 25=0.1656, 100=0.1183, 250=0.0804, 500=0.071, 1000=0.0556 (USD); Emitting Color: Red; Lens Dimensions: 1.4x1.25x0.5 mm; Luminous Intensity: 54mcd; Mounting: Surface Mount; Operating Temp Range: -55C to 85C; Operating Temperature Classification: Industrial; Package Type: Chip Led; Packaging: Tape and Reel; Pin Count: 2; ComponentLink1URL: https://datasheet.ciiva.com/2110/s-110-ltst-c171krkt-2110066.pdf; ComponentLink1Description: https://datasheet.ciiva.com/2110/s-110-ltst-c171krkt-2110066.pdf; ComponentLink2URL: https://datasheet.ciiva.com/2110/s-110-ltst-c171krkt-2110067.pdf; ComponentLink2Description: https://datasheet.ciiva.com/2110/s-110-ltst-c171krkt-2110067.pdf; ComponentLink3URL: https://datasheet.ciiva.com/2110/s-110-ltst-c171krkt-2110068.pdf; ComponentLink3Description: https://datasheet.ciiva.com/2110/s-110-ltst-c171krkt-2110068.pdf; ComponentLink4URL: https://datasheet.ciiva.com/12403/lite-on-ltst-c171krkt-187201-12403781.pdf; ComponentLink4Description: https://datasheet.ciiva.com/12403/lite-on-ltst-c171krkt-187201-12403781.pdf; ComponentLink5URL: https://datasheet.ciiva.com/11775/0900766b80dc0299-11775643.pdf; ComponentLink5Description: https://datasheet.ciiva.com/11775/0900766b80dc0299-11775643.pdf; ComponentLink6URL: https://datasheet.ciiva.com/16444/lite-on20ltst-c171krkt-16444779.pdf; ComponentLink6Description: https://datasheet.ciiva.com/16444/lite-on20ltst-c171krkt-16444779.pdf; Supplier Part Number 1: 160-1427-1-ND
D502 = LED_ORANGE.0805.1: LED ORANGE DIFFUSED 0805 SMD; Manufacturer: Rohm; Manufacturer Part Number: SML-210DTT86; Intensity: 6.3 mcd; Lens Type: Clear; Forward (Drive) Current: 25 mA; Forward Voltage: 2 V; Viewing Angle: 130 °; Supplier 1: Digikey; Stock 1: 28453; Pricing 1: 1=0.39, 10=0.277, 25=0.2404, 100=0.1848, 250=0.1502, 500=0.1109, 1000=0.0924 (USD); Color: Orange; Dimension: 2 x 1.25 x 0.8 mm; ComponentLink1URL: https://datasheet.ciiva.com/2110/sml-21-2110727.pdf; ComponentLink1Description: https://datasheet.ciiva.com/2110/sml-21-2110727.pdf; ComponentLink2URL: https://datasheet.ciiva.com/2110/sml-21-2110728.pdf; ComponentLink2Description: https://datasheet.ciiva.com/2110/sml-21-2110728.pdf; ComponentLink3URL: https://datasheet.ciiva.com/2110/sml-21-2110729.pdf; ComponentLink3Description: https://datasheet.ciiva.com/2110/sml-21-2110729.pdf; ComponentLink4URL: https://datasheet.ciiva.com/11773/0900766b80df3a40-11773931.pdf; ComponentLink4Description: https://datasheet.ciiva.com/11773/0900766b80df3a40-11773931.pdf; ComponentLink5URL: https://datasheet.ciiva.com/16488/sml-210ltt86-16488028.pdf; ComponentLink5Description: https://datasheet.ciiva.com/16488/sml-210ltt86-16488028.pdf; Supplier Part Number 1: 511-1284-1-ND
D503 = LED_YELLOW_0805.1: LED YELLOW CLEAR THIN 0805 SMD; Manufacturer: Vishay / Lite-On; Manufacturer Part Number: LTST-C171KSKT; Chip Material: AlGaInP; DELETED: Compliant; Emitting Color: Amber; Forward Voltage: 2.4 V; Forward Current: 30 mA; Dominant Wave Length: 587 nm; Lum Intensity: 50mcd; High Brightness: Yes; Number of  Elements: 1; Main Category: Chip LED; Power Dissipation: 75 W; Peak Wavelength: 588 nm; Shape Type: Rectangular; Type: Uni-Color; Reverse Voltage: 5 V; Viewing Angle: 130 deg; Test Current (It): 20 mA; Rad Hardened: No; Product Depth (mm): 1.25 mm; Product Height (mm): 0.8 mm; Product Length (mm): 2 mm; Supplier 1: Digikey; Stock 1: 18113; Pricing 1: 1=0.33, 10=0.239, 25=0.1764, 100=0.126, 250=0.0856, 500=0.0756, 1000=0.0592 (USD); Mounting: Surface Mount; Operating Temp Range: -55C to 85C; Lens Dimensions: 1.4x1.25x0.5 mm; Luminous Intensity: 50mcd; Package Type: Chip Led; Packaging: Tape and Reel; Pin Count: 2; Operating Temperature Classification: Industrial; ComponentLink1URL: https://datasheet.ciiva.com/15118/getdatasheetpartid-233685-15118145.pdf; ComponentLink1Description: https://datasheet.ciiva.com/15118/getdatasheetpartid-233685-15118145.pdf; ComponentLink2URL: https://datasheet.ciiva.com/2110/s-110-ltst-c171kskt-2110147.pdf; ComponentLink2Description: https://datasheet.ciiva.com/2110/s-110-ltst-c171kskt-2110147.pdf; ComponentLink3URL: https://datasheet.ciiva.com/2110/s-110-ltst-c171kskt-2110148.pdf; ComponentLink3Description: https://datasheet.ciiva.com/2110/s-110-ltst-c171kskt-2110148.pdf; ComponentLink4URL: https://datasheet.ciiva.com/19466/2075639-19466196.pdf; ComponentLink4Description: https://datasheet.ciiva.com/19466/2075639-19466196.pdf; ComponentLink5URL: https://datasheet.ciiva.com/2110/s-110-ltst-c171kskt-2110149.pdf; ComponentLink5Description: https://datasheet.ciiva.com/2110/s-110-ltst-c171kskt-2110149.pdf; ComponentLink6URL: https://datasheet.ciiva.com/16200/lite-on20ltst-c171kskt-16200102.pdf; ComponentLink6Description: https://datasheet.ciiva.com/16200/lite-on20ltst-c171kskt-16200102.pdf; ComponentLink7URL: https://datasheet.ciiva.com/12403/lite-on-ltst-c171kskt-190118-12403721.pdf; ComponentLink7Description: https://datasheet.ciiva.com/12403/lite-on-ltst-c171kskt-190118-12403721.pdf; ComponentLink8URL: https://datasheet.ciiva.com/11774/0900766b80dc029a-11774587.pdf; ComponentLink8Description: https://datasheet.ciiva.com/11774/0900766b80dc029a-11774587.pdf; Supplier Part Number 1: 160-1428-1-ND
Q500-Q503 = IC_NMOS_DMN2020LSN: Manufacturer: Diodes; Manufacturer Part Number: DMN2020LSN-7; Rise Time: 12.49ns; Continuous Drain Current (ID): 6.9A; Gate to Source Voltage (Vgs): 12V; Turn-Off Delay Time: 35.89ns; Turn-On Delay Time: 11.67ns; Fall Time: 12.33ns; Input Capacitance: 1.149nF; Number of Elements: 1; Max Power Dissipation: 610mW; Rds On Max: 20mR; Drain to Source Resistance: 13mR; Drain to Source Voltage (Vdss): 20V; Threshold Voltage: 1V; Element Configuration: Single; Supplier 1: Digikey; Stock 1: 13099; Pricing 1: 1=0.52, 10=0.418, 100=0.2843, 500=0.2132, 1000=0.1599 (USD); Mount: Surface Mount; Case/Package: SC; Number of Pins: 3; Weight: 0.000282oz; Min Operating Temperature: -55°C; Max Operating Temperature: 150°C; Packaging: Tape and Reel; Package Quantity: 3000; Power Dissipation: 610mW; Number of Channels: 1; Length: 3.1mm; Height: 1.3mm; Width: 1.7mm; REACH SVHC: No SVHC; Lead Free: Lead Free; ComponentLink1URL: https://datasheet.ciiva.com/934/ds31946-934870.pdf; ComponentLink1Description: https://datasheet.ciiva.com/934/ds31946-934870.pdf; ComponentLink2URL: https://datasheet.ciiva.com/25625/0900766b8104e58b-25625153.pdf; ComponentLink2Description: https://datasheet.ciiva.com/25625/0900766b8104e58b-25625153.pdf; ComponentLink3URL: https://datasheet.ciiva.com/4444/ds31946-65244-4444482.pdf; ComponentLink3Description: https://datasheet.ciiva.com/4444/ds31946-65244-4444482.pdf; ComponentLink4URL: https://datasheet.ciiva.com/934/ds31946-934871.pdf; ComponentLink4Description: https://datasheet.ciiva.com/934/ds31946-934871.pdf; ComponentLink5URL: https://datasheet.ciiva.com/934/ds31946-934872.pdf; ComponentLink5Description: https://datasheet.ciiva.com/934/ds31946-934872.pdf; Supplier Part Number 1: DMN2020LSN-7DICT-ND
R500-R503 = RES_0805_R_330.00: RES SMD 330 OHM 1% 1/8W 0805; Manufacturer: Yageo; Manufacturer Part Number: RC0805FR-07330RL; Power (Watts): 0.125W, 1/8W; Temperature Coefficient: ±100ppm/°C; Supplier 1: Digi-Key; RoHS: RoHS Compliant; Category: Resistors; Stock 1: 1392719; Pricing 1: 1=0.1, 10=0.022, 100=0.0088, 1000=0.00396, 2500=0.00344 (USD); Packaging: Cut Tape (CT); Part Status: Active; Tolerance: ±1%; Composition: Thick Film; Features: Moisture Resistant; Operating Temperature: -55°C ~ 155°C; Package / Case: 0805 (2012 Metric); Supplier Device Package: 0805; Size / Dimension: 0.079" L x 0.049" W (2.00mm x 1.25mm); Height - Seated (Max): 0.024" (0.60mm); Failure Rate: -; ComponentLink1URL: http://www.yageo.com/documents/recent/PYu-RC_Group_51_RoHS_L_8.pdf; ComponentLink1Description: http://www.yageo.com/documents/recent/PYu-RC_Group_51_RoHS_L_8.pdf; Supplier Part Number 1: 311-330CRCT-ND
R504-R507 = RES_0805_K_010.00: as R300 on sheet 03_MCU; Supplier 1: Digi-Key; RoHS: RoHS Compliant; Category: Resistors; Stock 1: 15506828; Pricing 1: 1=0.1, 10=0.022, 100=0.0088, 1000=0.00396, 2500=0.00344 (USD); Packaging: Cut Tape (CT); Part Status: Active; Tolerance: ±1%; Composition: Thick Film; Features: Moisture Resistant; Operating Temperature: -55°C ~ 155°C; Package / Case: 0805 (2012 Metric); Supplier Device Package: 0805; Size / Dimension: 0.079" L x 0.049" W (2.00mm x 1.25mm); Height - Seated (Max): 0.024" (0.60mm); Failure Rate: -; ComponentLink1URL: http://www.yageo.com/documents/recent/PYu-RC_Group_51_RoHS_L_8.pdf; ComponentLink1Description: http://www.yageo.com/documents/recent/PYu-RC_Group_51_RoHS_L_8.pdf

## Sheet 06_Buzzer.SchDoc: ECE315 Buzzer
size A; Date: 4/25/2017; ApprovedBy: JSK; CheckedBy: JSK; Author: JSK; CompanyName: University of Wisconsin; DrawnBy: JSK; Engineer: JSK; Organization: ECE 315; Address1: College of Engineering; Address2: 1415 Engineering Drive; Address3: Madison, WI 53706; Address4: ECE 315 Spring 2018; Revision: A; SheetNumber: 6; SheetTotal: 6; AssemblyNumber: ECE315-S18; ApprovedDate: 01/08/2018
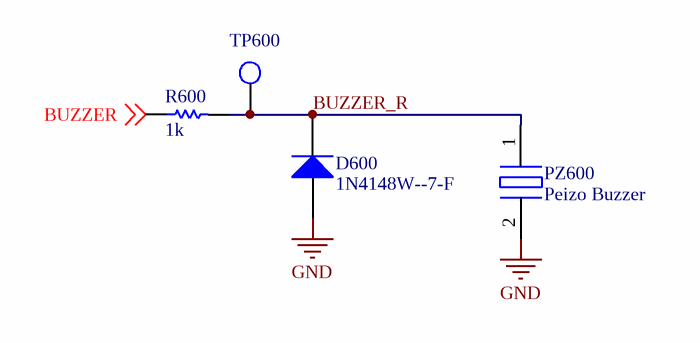
[diagram p5: 06_Buzzer.SchDoc]

### Parts
D600  Manufacturer Part Number: 1N4148W--7-F  [SOD323-12]  (hidden comment: DIODE_4148)
PZ600  Peizo Buzzer  [PKLCS]
R600  Resistance (Ohms): 1k  [RES_0805]  (hidden comment: RES_0805_K_001.00)
TP600  TP_1206  [TP-SMC-1206]  (value not drawn)

### Nets
GND: D600.2(A) PZ600.2(In)
BUZZER: R600.1 ; off-sheet BUZZER
BUZZER_R: D600.1(K) PZ600.1(In) R600.2 TP600.1

### Notes on the sheet
- Title:
- Size:
- A
- Machine:
- P.C. Board No:
- Assembly No:
- Rev:
- Sheet:
- of
- College of Engineering
- 1415 Engineering Drive
- Madison, WI 53706

### Library data of the parts
D600 = DIODE_4148: DIODE GEN PURP 100V 300MA SOD123; Manufacturer: Diodes; Diode Configuration: Single; Number of Elements per Chip: 1; Maximum Forward Voltage: 1.25V; Supplier 1: Digi-Key; Stock 1: 993734; Pricing 1: 1=0.18, 10=0.164, 100=0.0891, 500=0.0548, 1000=0.0374 (USD); Mounting Type: Surface Mount; Maximum Reverse Voltage: 100V; Package Type: SOD-123; Pin Count: 2; ComponentLink1URL: http://uk.rs-online.com/webdocs/0f8c/0900766b80f8c94e.pdf; ComponentLink1Description: http://uk.rs-online.com/webdocs/0f8c/0900766b80f8c94e.pdf; Supplier Part Number 1: 1N4148W-FDICT-ND
PZ600 = Peizo: AUDIO PIEZO TRANSDUCER 12.5V SMD; Manufacturer Part Number: PKLCS1212E2000-R1; Manufacturer: Murata Electronics North America; Voltage Range: 12.5V (Max); Sound Pressure Level: 70dB @ 1.5V, 10cm; Input Type: Zero-Peak Signal; Voltage - Rated: 1.5V; Driver Circuitry: Transducer, Externally Driven; Port Location: Side; Frequency: 2kHz; Operating Mode: Single Tone; Supplier: Digi-Key; RoHS: RoHS Compliant; Mounting Type: Surface Mount; Category: Audio Products; Termination: Solder Pads; Operating Temperature: -20°C ~ 70°C; Size / Dimension: 12.0mm L x 12.0mm W x 3.0mm H; Packaging: Cut Tape (CT); Technology: Piezo; Supplier Part Number: 490-5260-1-ND
R600 = RES_0805_K_001.00: RES SMD 1K OHM 1% 1/8W 0805; Manufacturer Part Number: ERJ-6ENF1001V; Manufacturer: Panasonic Electronic Components; Temperature Coefficient: ±100ppm/°C; Power (Watts): 0.125W, 1/8W; Failure Rate: -; Category: Resistors; Operating Temperature: -55°C ~ 155°C; RoHS: RoHS Compliant; Height - Seated (Max): 0.028" (0.70mm); Package / Case: 0805 (2012 Metric); Part Status: Active; Supplier: Digi-Key; Size / Dimension: 0.079" L x 0.049" W (2.00mm x 1.25mm); Composition: Thick Film; Features: Automotive AEC-Q200; Number of Terminations: 2; Tolerance: ±1%; Packaging: Cut Tape (CT); Supplier Device Package: 0805; Supplier Part Number: P1.00KCCT-ND
TP600 = TP_1206: as TP200 on sheet 02-Power; Supplier 1: Digi-Key; Supplier Part Number 1: A106143CT-ND; Stock 1: 31937; Pricing 1: 1=0.28, 10=0.261, 25=0.224, 50=0.1902, 100=0.1828, 250=0.1641, 500=0.1567, 1000=0.1306 (USD); Case Size: 1206; Dimension: 3.2 x 1.6 x 1.25mm; Family: RC; Mounting: Surface Mount; Operating Temperature: -55 to 125 C; Part No: 1625854-1; RoHS: Yes; Packaging: Tape and Reel; Termination Style: N/R; Terminal Pitch: N/R; Power Rating: N/R; Tolerance: N/R; ComponentLink1URL: https://datasheet.ciiva.com/6439/eng-ds-1773266-a-6439169.pdf; ComponentLink1Description: https://datasheet.ciiva.com/6439/eng-ds-1773266-a-6439169.pdf; ComponentLink2URL: https://datasheet.ciiva.com/30136/1773266-a-30136341.pdf; ComponentLink2Description: https://datasheet.ciiva.com/30136/1773266-a-30136341.pdf; ComponentLink3URL: https://datasheet.ciiva.com/6439/eng-ds-1773266-a-6439080.pdf; ComponentLink3Description: https://datasheet.ciiva.com/6439/eng-ds-1773266-a-6439080.pdf; ComponentLink4URL: https://datasheet.ciiva.com/6439/eng-ds-1773266-a-6439081.pdf; ComponentLink4Description: https://datasheet.ciiva.com/6439/eng-ds-1773266-a-6439081.pdf; ComponentLink5URL: https://datasheet.ciiva.com/6439/eng-ds-1773266-a-6439083.pdf; ComponentLink5Description: https://datasheet.ciiva.com/6439/eng-ds-1773266-a-6439083.pdf

## Nets that join several sheets
3V_VCC: 02-Power (S200.2 S200.5 TP200.1), 03_MCU (8 pins), 04_CapTouch (6 pins), 05_LEDs (R500.2 R501.2 R502.2 R503.2)
GND: 02-Power (J201.3 J201.4 Q200.2 TP204.1), 03_MCU (10 pins), 04_CapTouch (C400.2 U400.10 U400.12), 05_LEDs (8 pins), 06_Buzzer (D600.2 PZ600.2)
BUZZER: 03_MCU (U300.14), 06_Buzzer (R600.1)
G_EN: 03_MCU (U300.28), 05_LEDs (Q500.1 R504.2)
I2C1_SCLK: 03_MCU (R301.1 TP301.1 U300.29), 04_CapTouch (R400.1 U400.16)
I2C1_SDA: 03_MCU (R300.1 TP300.1 U300.30), 04_CapTouch (R401.1 U400.13)
NRST: 02-Power (J201.1), 03_MCU (C301.1 U300.4 U301.3)
O_EN: 03_MCU (U300.26), 05_LEDs (Q502.1 R506.2)
R_EN: 03_MCU (U300.15), 05_LEDs (Q501.1 R505.2)
SWCLK: 02-Power (J201.6), 03_MCU (U300.24)
SWDIO: 02-Power (J201.2), 03_MCU (U300.23)
TOUCH_IRQ: 03_MCU (U300.25), 04_CapTouch (R402.1 U400.17)
Y_EN: 03_MCU (U300.27), 05_LEDs (Q503.1 R507.2)